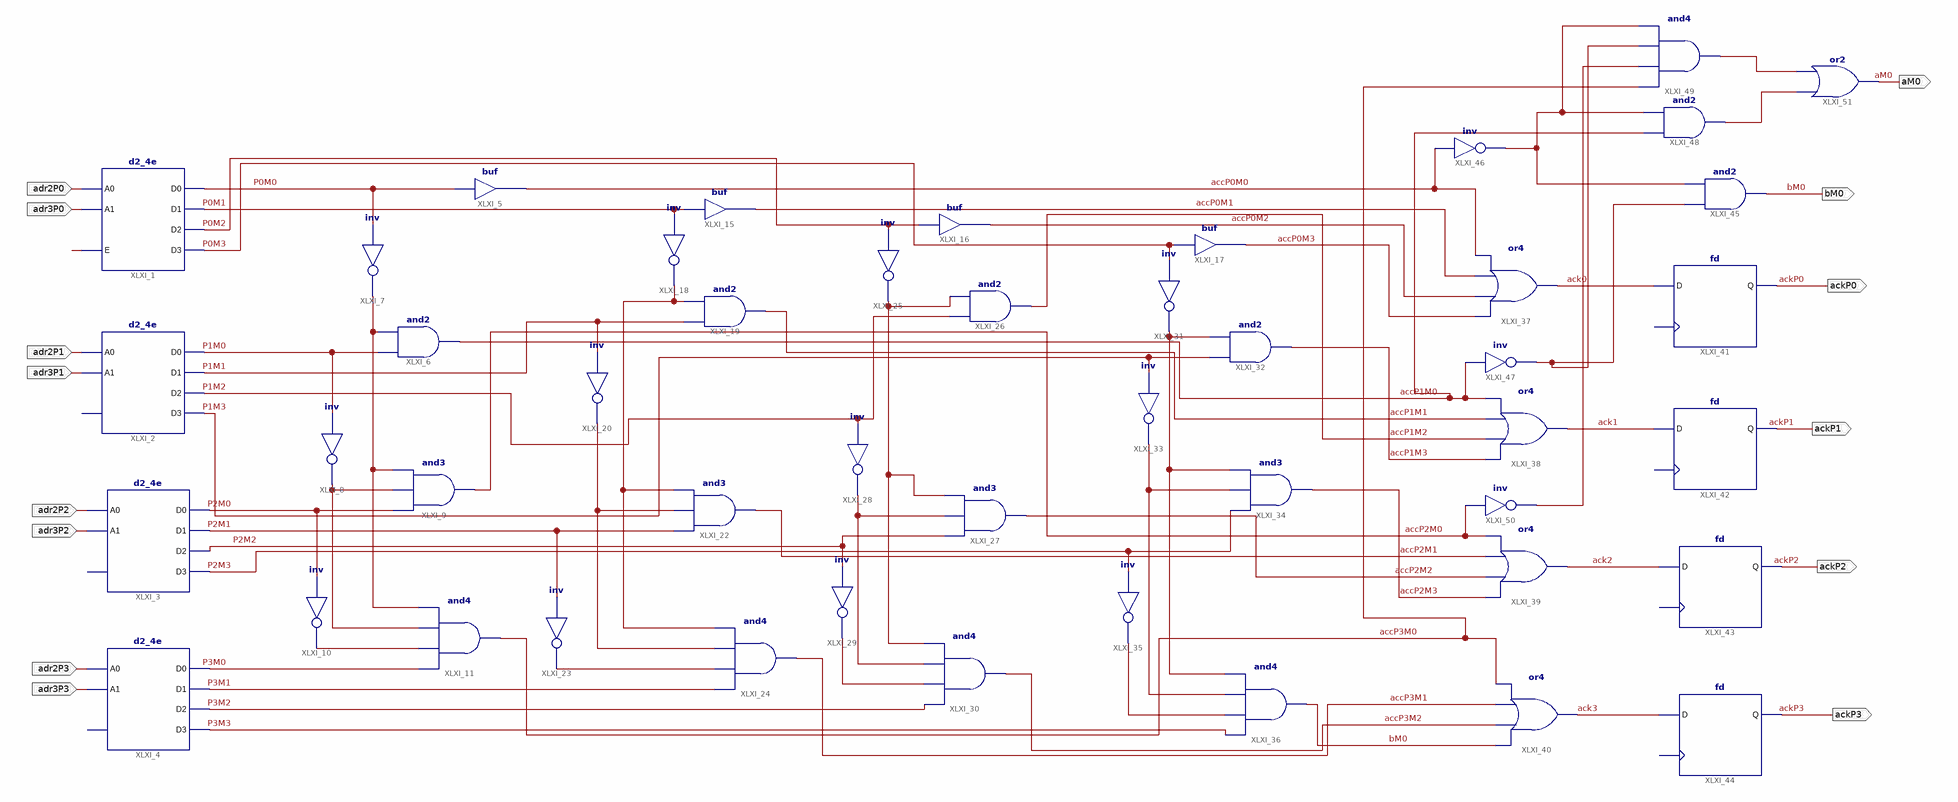
[diagram p0: schematic sheet 1]
// Xilinx ISE schematic crossbar.sch (artix7) as structural Verilog: 47 symbols, 14 ports
module crossbar (
  input  adr3P0,
  input  adr2P1,
  input  adr3P1,
  input  adr2P2,
  input  adr3P2,
  input  adr2P3,
  input  adr3P3,
  input  adr2P0,
  output bM0,
  output ackP0,
  output ackP1,
  output ackP2,
  output ackP3,
  output aM0
);

  wire accP0M0, accP0M1, accP0M2, accP0M3, accP1M0, accP1M1, accP1M2, accP1M3, accP2M0, accP2M1, accP2M2,
       accP2M3, accP3M0, accP3M1, accP3M2, ack0, ack1, ack2, ack3, P0M0, P0M1, P0M2, P0M3, P1M0, P1M1, P1M2,
       P1M3, P2M0, P2M1, P2M2, P2M3, P3M0, P3M1, P3M2, P3M3, XLXN_5, XLXN_16, XLXN_40, XLXN_46, XLXN_61,
       XLXN_62, XLXN_69, XLXN_97, XLXN_99, XLXN_104, XLXN_107, XLXN_108, XLXN_113, XLXN_146, XLXN_153,
       XLXN_155, XLXN_156, XLXN_157;

  d2_4e XLXI_1 (.A0(adr2P0), .A1(adr3P0), .E(XLXN_5), .D0(P0M0), .D1(P0M1), .D2(P0M2), .D3(P0M3));
  d2_4e XLXI_2 (.A0(adr2P1), .A1(adr3P1), .D0(P1M0), .D1(P1M1), .D2(P1M2), .D3(P1M3));  // open: E
  d2_4e XLXI_3 (.A0(adr2P2), .A1(adr3P2), .D0(P2M0), .D1(P2M1), .D2(P2M2), .D3(P2M3));  // open: E
  d2_4e XLXI_4 (.A0(adr2P3), .A1(adr3P3), .D0(P3M0), .D1(P3M1), .D2(P3M2), .D3(P3M3));  // open: E
  buf XLXI_5 (accP0M0, P0M0);
  and XLXI_6 (accP1M0, P1M0, XLXN_16);
  not XLXI_7 (XLXN_16, P0M0);
  not XLXI_8 (XLXN_40, P1M0);
  and XLXI_9 (accP2M0, P2M0, XLXN_40, XLXN_16);
  not XLXI_10 (XLXN_46, P2M0);
  and XLXI_11 (accP3M0, P3M0, XLXN_46, XLXN_40, XLXN_16);
  buf XLXI_15 (accP0M1, P0M1);
  buf XLXI_16 (accP0M2, P0M2);
  buf XLXI_17 (accP0M3, P0M3);
  not XLXI_18 (XLXN_61, P0M1);
  and XLXI_19 (accP1M1, P1M1, XLXN_61);
  not XLXI_20 (XLXN_62, P1M1);
  and XLXI_22 (accP2M1, P2M1, XLXN_62, XLXN_61);
  not XLXI_23 (XLXN_69, P2M1);
  and XLXI_24 (accP3M1, P3M1, XLXN_69, XLXN_62, XLXN_61);
  not XLXI_25 (XLXN_97, P0M2);
  and XLXI_26 (accP1M2, P1M2, XLXN_97);
  and XLXI_27 (accP2M2, P2M2, XLXN_99, XLXN_97);
  not XLXI_28 (XLXN_99, P1M2);
  not XLXI_29 (XLXN_104, P2M2);
  and XLXI_30 (accP3M2, P3M2, XLXN_104, XLXN_99, XLXN_97);
  not XLXI_31 (XLXN_107, P0M3);
  and XLXI_32 (accP1M3, P1M3, XLXN_107);
  not XLXI_33 (XLXN_108, P1M3);
  and XLXI_34 (accP2M3, P2M3, XLXN_108, XLXN_107);
  not XLXI_35 (XLXN_113, P2M3);
  and XLXI_36 (bM0, P3M3, XLXN_113, XLXN_108, XLXN_107);
  or XLXI_37 (ack0, accP0M3, accP0M2, accP0M1, accP0M0);
  or XLXI_38 (ack1, accP1M3, accP1M2, accP1M1, accP1M0);
  or XLXI_39 (ack2, accP2M3, accP2M2, accP2M1, accP2M0);
  or XLXI_40 (ack3, bM0, accP3M2, accP3M1, accP3M0);
  fd XLXI_41 (.D(ack0), .Q(ackP0));  // open: C
  fd XLXI_42 (.D(ack1), .Q(ackP1));  // open: C
  fd XLXI_43 (.D(ack2), .Q(ackP2));  // open: C
  fd XLXI_44 (.D(ack3), .Q(ackP3));  // open: C
  and XLXI_45 (bM0, XLXN_146, XLXN_153);
  not XLXI_46 (XLXN_153, accP0M0);
  not XLXI_47 (XLXN_146, accP1M0);
  and XLXI_48 (XLXN_157, accP1M0, XLXN_153);
  and XLXI_49 (XLXN_156, accP3M0, XLXN_155, XLXN_146, XLXN_153);
  not XLXI_50 (XLXN_155, accP2M0);
  or XLXI_51 (aM0, XLXN_157, XLXN_156);
endmodule
